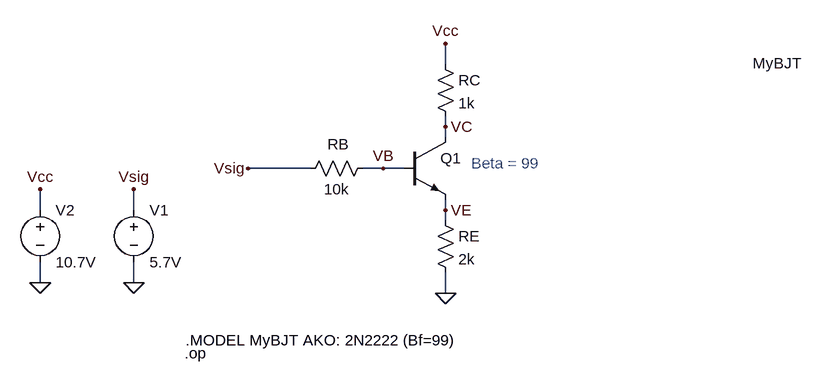
[diagram p0: schematic bjt-question-1.asc]
bjt-question-1.asc, the LTspice schematic file:
Version 4
SHEET 1 1080 680
WIRE 528 -96 528 -128
WIRE 528 0 528 -16
WIRE 528 16 528 0
WIRE 320 64 224 64
WIRE 432 64 400 64
WIRE 464 64 432 64
WIRE -96 128 -96 96
WIRE 48 128 48 96
WIRE 528 128 528 112
WIRE 528 144 528 128
WIRE -96 240 -96 208
WIRE 48 240 48 208
WIRE 528 256 528 224
FLAG 48 240 0
FLAG -96 240 0
FLAG 528 256 0
FLAG 432 64 VB
FLAG 528 0 VC
FLAG 528 128 VE
FLAG 528 -128 Vcc
FLAG -96 96 Vcc
FLAG 48 96 Vsig
FLAG 224 64 Vsig
SYMBOL voltage 48 112 R0
SYMATTR InstName V1
SYMATTR Value 5.7V
SYMBOL res 416 48 R90
WINDOW 0 -6 53 VBottom 2
WINDOW 3 32 56 VTop 2
SYMATTR InstName RB
SYMATTR Value 10k
SYMBOL npn 464 16 R0
WINDOW 3 537 -114 Left 2
SYMATTR InstName Q1
SYMATTR Value MyBJT
SYMBOL res 512 -112 R0
SYMATTR InstName RC
SYMATTR Value 1k
SYMBOL res 512 128 R0
SYMATTR InstName RE
SYMATTR Value 2k
SYMBOL voltage -96 112 R0
SYMATTR InstName V2
SYMATTR Value 10.7V
TEXT 128 328 Left 2 !.MODEL MyBJT AKO: 2N2222 (Bf=99)
TEXT 126 348 Left 2 !.op
TEXT 568 56 Left 2 ;Beta = 99

The netlist it stands for:
* bjt-question-1.asc
V1 Vsig 0 5.7V
RB VB Vsig 10k
Q1 VC VB VE 0 MyBJT
RC Vcc VC 1k
RE VE 0 2k
V2 Vcc 0 10.7V
.model NPN NPN
.model PNP PNP
.lib standard.bjt
.MODEL MyBJT AKO: 2N2222 (Bf=99)
.op
* Beta = 99
.backanno
.end